# Altium schematic sheet efr32_vna.SchDoc
size A4
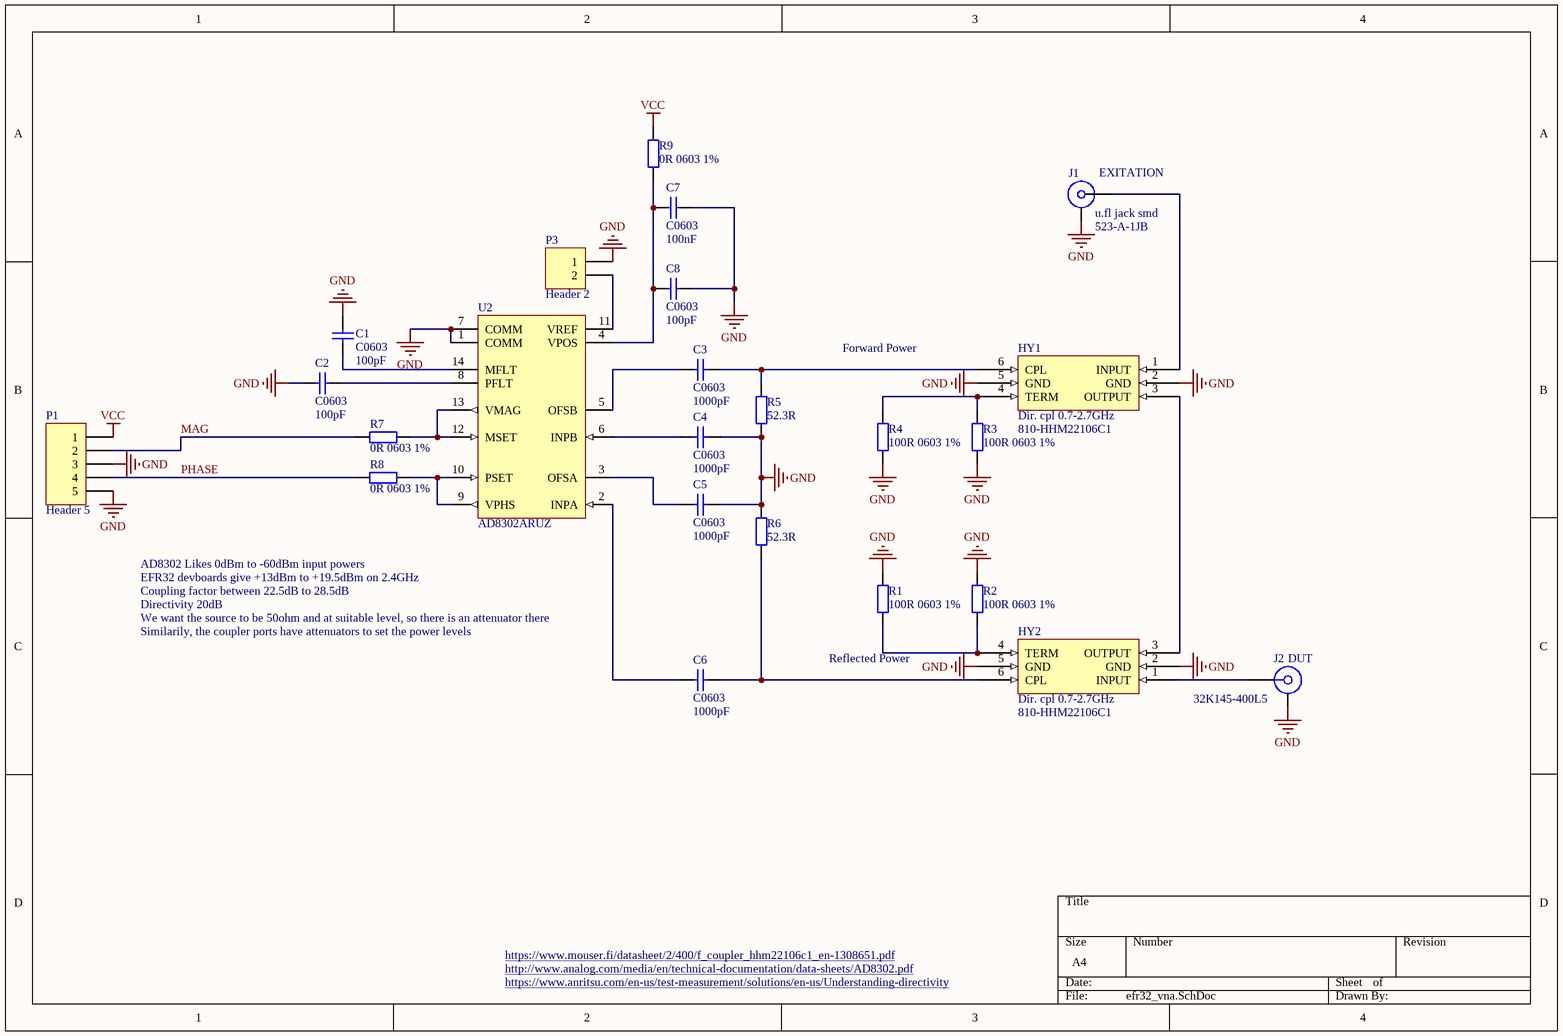
[diagram p0: efr32_vna.SchDoc]

## Parts
C1  C0603  value 100pF  [0603]
C2  C0603  value 100pF  [0603]
C3  C0603  value 1000pF  [0603]
C4  C0603  value 1000pF  [0603]
C5  C0603  value 1000pF  [0603]
C6  C0603  value 1000pF  [0603]
C7  C0603  value 100nF  [0603]
C8  C0603  value 100pF  [0603]
HY1  Dir. cpl 0.7-2.7GHz  Supplier Part Number 1: 810-HHM22106C1  [1.6x0.8mm [EIA 0603]]
HY2  Dir. cpl 0.7-2.7GHz  Supplier Part Number 1: 810-HHM22106C1  [1.6x0.8mm [EIA 0603]]
J1  u.fl jack smd  Supplier Part Number 1: 523-A-1JB  [U.FL jack]
J2  32K145-400L5  [ROS-32K145-400L5_V]
P1  Header 5  [HDR1X5]
P3  Header 2  [HDR1X2]
R1  100R 0603 1%  [R0603]
R2  100R 0603 1%  [R0603]
R3  100R 0603 1%  [R0603]
R4  100R 0603 1%  [R0603]
R5  52.3R  [R0603]
R6  52.3R  [R0603]
R7  0R 0603 1%  [R0603]
R8  0R 0603 1%  [R0603]
R9  0R 0603 1%  [R0603]
U2  AD8302ARUZ  [ADI-RU-14_L]

## Nets
GND: C1.2 C2.1 C4.2 C5.2 C7.2 C8.2 HY1.2(GND) HY1.5(GND) HY2.2(GND) HY2.5(GND) J1.2 J2.MP P1.3 P1.5 P3.1 R1.1 R2.1 R3.1 R4.1 R5.2 R6.1 U2.1(COMM) U2.7(COMM)
VCC: P1.1 R9.2
MAG: P1.2 R7.1
PHASE: P1.4 R8.1
NetC1_1: C1.1 U2.14(MFLT)
NetC2_2: C2.2 U2.8(PFLT)
NetC3_1: C3.1 U2.5(OFSB)
NetC3_2: C3.2 HY1.6(CPL) R5.1
NetC4_1: C4.1 U2.6(INPB)
NetC5_1: C5.1 U2.3(OFSA)
NetC6_1: C6.1 U2.2(INPA)
NetC6_2: C6.2 HY2.6(CPL) R6.2
NetC7_1: C7.1 C8.1 R9.1 U2.4(VPOS)
NetHY1_1: HY1.1(INPUT) J1.1
NetHY1_3: HY1.3(OUTPUT) HY2.3(OUTPUT)
NetHY1_4: HY1.4(TERM) R3.2 R4.2
NetHY2_1: HY2.1(INPUT) J2.1
NetHY2_4: HY2.4(TERM) R1.2 R2.2
NetP3_2: P3.2 U2.11(VREF)
NetR7_2: R7.2 U2.12(MSET) U2.13(VMAG)
NetR8_2: R8.2 U2.9(VPHS) U2.10(PSET)

## Notes on the sheet
- (near J1) EXITATION
- Forward Power
- AD8302 Likes 0dBm to -60dBm input powers
- EFR32 devboards give +13dBm to +19.5dBm on 2.4GHz
- Coupling factor between 22.5dB to 28.5dB
- Directivity 20dB
- We want the source to be 50ohm and at suitable level, so there is an attenuator there
- Similarily, the coupler ports have attenuators to set the power levels
- (near R1) Reflected Power
- (near J2) DUT
- https://www.anritsu.com/en-us/test-measurement/solutions/en-us/Understanding-directivity
- https://www.mouser.fi/datasheet/2/400/f_coupler_hhm22106c1_en-1308651.pdf
- http://www.analog.com/media/en/technical-documentation/data-sheets/AD8302.pdf

## Library data of the parts
C1-C8 = C0603: Ceramic Chip Capacitor - Standard; Note: Footprint corresponds to dimensions for bulk cassette packaging. This case size has tightened tolerances.; Published: 17-Jul-2002; LatestRevisionDate: 19-Mar-2004; LatestRevisionNote: Silkscreen size reduced.; DatasheetDocument: Mar-2001; PackageDocument: Mar-2001; PackageReference: 0603; Publisher: Altium Limited; Code_JEITA: 0603; Code_IPC: 1608 [0603]; ComponentLink1Description: Manufacturer Link; ComponentLink1URL: http://www.kemet.com/; ComponentLink2Description: Datasheet; ComponentLink2URL: http://www.kemet.com/kemet/web/homepage/kechome.nsf/vapubfilesname/F3102TA.pdf/$file/F3102TA.pdf
HY1 HY2 = HHM22106C1: 0.7-2.7GHz 28.5dB directional coupler; Manufacturer 1: TDK; Frequency: 700MHz; Insertion Loss: 0.2dB; Supplier 1: Mouser; Manufacturer Part Number 1: HHM22106C1; Stock 1: 2964; Pricing 1: 1=0.43, 10=0.336, 50=0.336, 100=0.191, 1000=0.118, 10000=0.092 (USD); Case/Package: 0603; Weight: 7.1E-05oz; Case Code (Metric): 1608; Case Code (Imperial): 0603; Min Operating Temperature: -40°C; Max Operating Temperature: 85°C; Packaging: Tape and Reel; Termination: SMD/SMT; Package Quantity: 4000; ComponentLink1URL: //media.digikey.com/pdf/Data%20Sheets/TDK%20PDFs/HHM22106C1.pdf; ComponentLink1Description: //media.digikey.com/pdf/Data%20Sheets/TDK%20PDFs/HHM22106C1.pdf; ComponentLink2URL: https://product.tdk.com/info/en/documents/data_sheet/rf_coupler_hhm2910e4_en.pdf; ComponentLink2Description: https://product.tdk.com/info/en/documents/data_sheet/rf_coupler_hhm2910e4_en.pdf
J1 = u.fl connector, jack A-1JB: Manufacturer 1: Amphenol / Amphenol RF; Manufacturer Part Number 1: A-1JB; Connector Type: AMC Coaxial; Body Style: Straight Jack; Coaxial Termination: Solder; Impedance: 50ohm; Frequency Max: 6GHz; Supplier 1: Mouser; Stock 1: 19506; Pricing 1: 1=0.65, 10=0.596, 50=0.535, 100=0.51, 1000=0.365, 10000=0.351 (USD); Contact Material: Brass; Contact Plating: Gold; ComponentLink1URL: https://datasheet.ciiva.com/22652/689597-22652949.pdf; ComponentLink1Description: https://datasheet.ciiva.com/22652/689597-22652949.pdf; ComponentLink2URL: https://datasheet.ciiva.com/15172/getdatasheetpartid-168895-15172647.pdf; ComponentLink2Description: https://datasheet.ciiva.com/15172/getdatasheetpartid-168895-15172647.pdf; ComponentLink3URL: https://datasheet.ciiva.com/36526/2036357-36526267.pdf; ComponentLink3Description: https://datasheet.ciiva.com/36526/2036357-36526267.pdf; ComponentLink4URL: https://datasheet.ciiva.com/5175/ca-1jb-38743-5175829.pdf; ComponentLink4Description: https://datasheet.ciiva.com/5175/ca-1jb-38743-5175829.pdf; ComponentLink5URL: https://datasheet.ciiva.com/3132/ca-1jb-3132240.pdf; ComponentLink5Description: https://datasheet.ciiva.com/3132/ca-1jb-3132240.pdf; ComponentLink6URL: https://datasheet.ciiva.com/14157/04614608-14157589.pdf; ComponentLink6Description: https://datasheet.ciiva.com/14157/04614608-14157589.pdf; ComponentLink7URL: https://datasheet.ciiva.com/643/ca-1jb-643532.pdf; ComponentLink7Description: https://datasheet.ciiva.com/643/ca-1jb-643532.pdf; ComponentLink8URL: https://datasheet.ciiva.com/14565/70142555-14565783.pdf; ComponentLink8Description: https://datasheet.ciiva.com/14565/70142555-14565783.pdf; ComponentLink9URL: https://datasheet.ciiva.com/643/ca-1jb-643531.pdf; ComponentLink9Description: https://datasheet.ciiva.com/643/ca-1jb-643531.pdf
J2 = 32K145-400L5: SMA Right Angle Jack, Edge Mount, Up to 18 GHz, -55 to 155 degC; Design Note 1: Footprint in library is a generic example - only application specific footprint delivers High Performance; Desgin Note 2: For more information about DRC setting, please look at following webpage, http://techdocs.altium.com/display/SCRT/Design+Rule+for+Edge-Mount+Connectors; DatasheetVersion: b00; PackageVersion: b00; PackageReference: 32K145-400L5; PackageDescription: SMA Right Angle Jack, Edge Mount, 14.25 x 9.5 x 4.46 mm; Mounting Technology: Surface Mount; PartNumber: 32K145-400L5; ComponentLink1Description: Manufacturer URL; ComponentLink1URL: http://www.rosenberger.de; ComponentLink2Description: Datasheet; ComponentLink2URL: http://rosenberger.de/ok/images/documents/db/32K145-400L5.pdf; ComponentLink3Description: Package Specification; ComponentLink3URL: http://rosenberger.de/ok/images/documents/db/32K145-400L5.pdf; ComponentLink4Description: Series Overview / Design Note; ComponentLink4URL: http://rosenberger.de/ok/images/documents/spez/32.pdf; ComponentLink5Description: Webshop / RFQ; ComponentLink5URL: http://www.rosenberger.com/en/contact/sales/
P1 = Header 5: Header, 5-Pin; LatestRevisionDate: 17-Jul-2002; LatestRevisionNote: Re-released for DXP Platform.; Publisher: Altium Limited
P3 = Header 2: Header, 2-Pin; LatestRevisionDate: 17-Jul-2002; LatestRevisionNote: Re-released for DXP Platform.; Publisher: Altium Limited
R1-R4 = 100R 0603: Publisher: iv; Case: 0603; Value: 100R; Tolerance: 1%
R5 R6 = 100R 0603: 100R 0603 1%; Publisher: iv; Case: 0603; Value: 100R; Tolerance: 1%
R7-R9 = 0R 0603: Value: 0R; Case: 0603; Tolerance: 1%; Publisher: iv
U2 = CMP-0284-00076-1: LF-2.7 GHz RF/IF Gain and Phase Detector, 60ns Response Time, RU-14, Pb-Free, 96 Tube; Voltage Supply (V): 2.7 to 5.5; RF Frequency (MHz): 2700; Dynamic Range (dB): 60dB; Supply Current: 19mA; Temp Stability (dB): 1dB; Product Description: Dual-Channel Gain and Phase Outputs; ComponentLink1URL: www.analog.com; Response Time (ns typ): 60ns; ComponentLink1Description: Manufacturer URL; Code_JEDEC: MO-153AB-1; ComponentLink3URL: http://www.analog.com/static/imported-files/packages/36057385283879153717235186773RU14.pdf; PackageReference: RU-14; PackageVersion: Aug-2002; DatasheetVersion: Rev. A; ComponentLink2URL: http://www.analog.com/static/imported-files/data_sheets/AD8302.pdf; ComponentLink3Description: Package Specification; PackageDescription: 14-Lead Thin Shrink Small Outline Package [TSSOP]; ComponentLink2Description: Datasheet